# Altium schematic sheet [08] - MMC SLOT.SchDoc: IMXBB
size A3; DocumentNumber: 8; Revision: 2.0; SheetNumber: 8; SheetTotal: 13
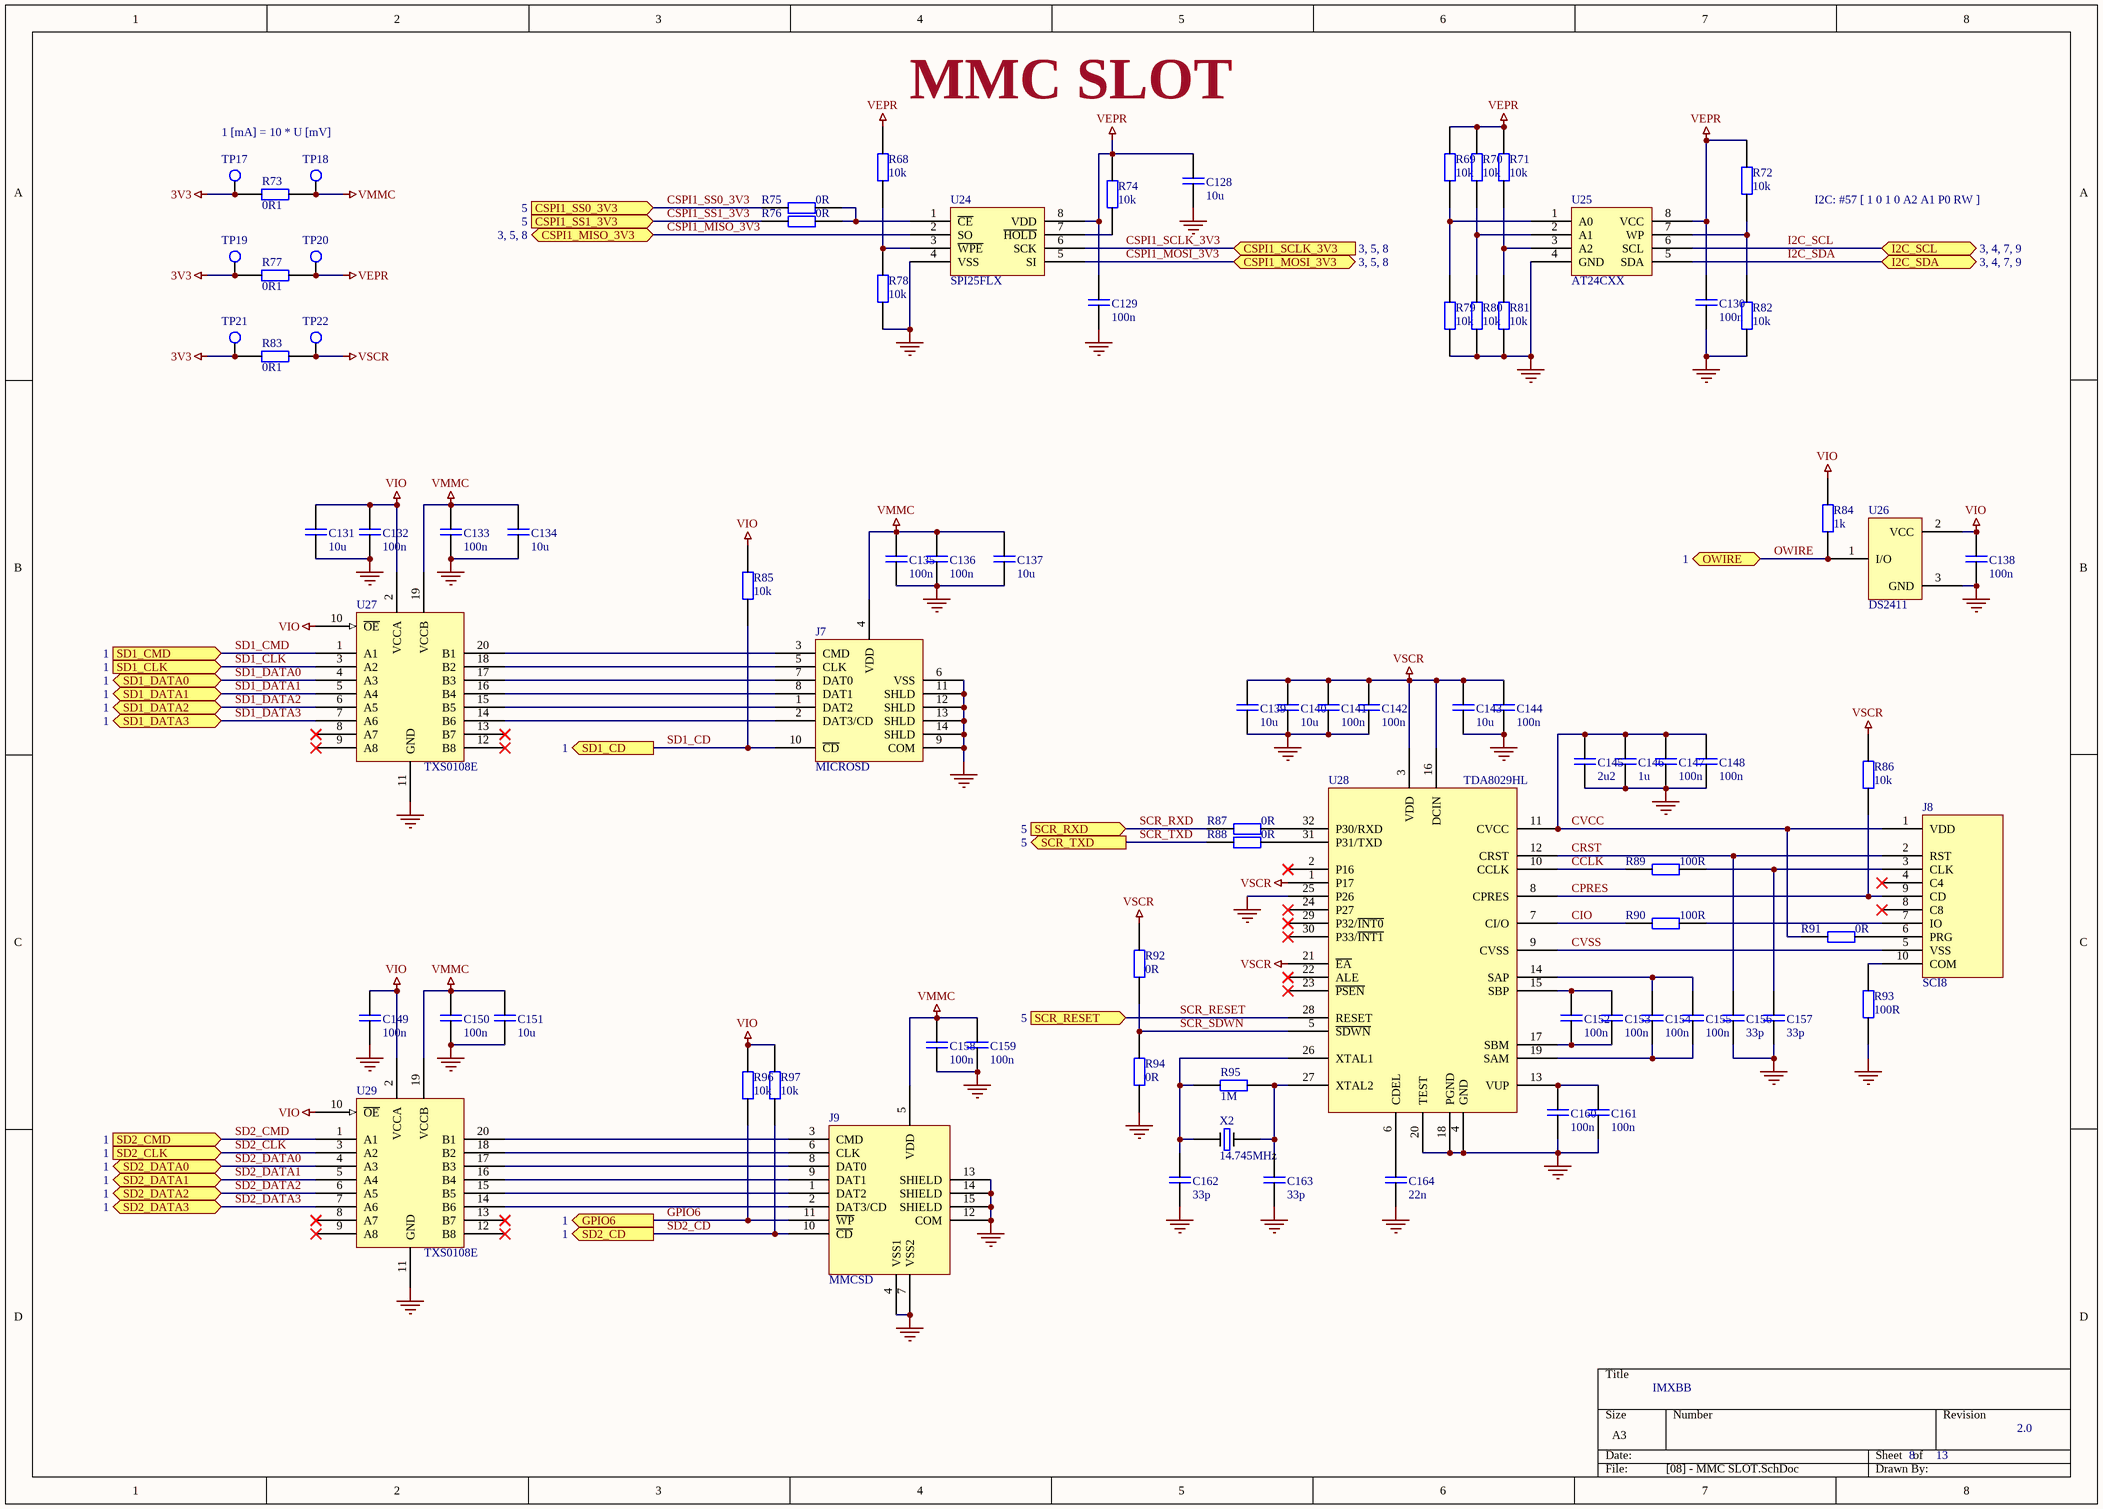
[diagram p0: [08] - MMC SLOT.SchDoc]

## Parts
C128  10u  [0805]
C129  100n  [0603]
C130  100n  [0603]
C131  10u  [0805]
C132  100n  [0603]
C133  100n  [0603]
C134  10u  [0805]
C135  100n  [0603]
C136  100n  [0603]
C137  10u  [0805]
C138  100n  [0603]
C139  10u  [0805]
C140  10u  [0805]
C141  100n  [0603]
C142  100n  [0603]
C143  10u  [0805]
C144  100n  [0603]
C145  2u2  [0603]
C146  1u  [0603]
C147  100n  [0603]
C148  100n  [0603]
C149  100n  [0603]
C150  100n  [0603]
C151  10u  [0805]
C152  100n  [0603]
C153  100n  [0603]
C154  100n  [0603]
C155  100n  [0603]
C156  33p  [0603]
C157  33p  [0603]
C158  100n  [0603]
C159  100n  [0603]
C160  100n  [0603]
C161  100n  [0603]
C162  33p  [0603]
C163  33p  [0603]
C164  22n  [0603]
J7  MICROSD  [uSD10]
J8  SCI8  [SCI8F]
J9  MMCSD  [SDCMF-109]
R68  10k  [0603]
R69  10k  [0603]
R70  10k  [0603]
R71  10k  [0603]
R72  10k  [0603]
R73  0R1  [0603]
R74  10k  [0603]
R75  0R  [0603]
R76  0R  [0603]
R77  0R1  [0603]
R78  10k  [0603]
R79  10k  [0603]
R80  10k  [0603]
R81  10k  [0603]
R82  10k  [0603]
R83  0R1  [0603]
R84  1k  [0603]
R85  10k  [0603]
R86  10k  [0603]
R87  0R  [0603]
R88  0R  [0603]
R89  100R  [0603]
R90  100R  [0603]
R91  0R  [0603]
R92  0R  [0603]
R93  100R  [0603]
R94  0R  [0603]
R95  1M  [0603]
R96  10k  [0603]
R97  10k  [0603]
TP17  TESTPOINT  [TESTPOINT_2mm]  (value not drawn)
TP18  TESTPOINT  [TESTPOINT_2mm]  (value not drawn)
TP19  TESTPOINT  [TESTPOINT_2mm]  (value not drawn)
TP20  TESTPOINT  [TESTPOINT_2mm]  (value not drawn)
TP21  TESTPOINT  [TESTPOINT_2mm]  (value not drawn)
TP22  TESTPOINT  [TESTPOINT_2mm]  (value not drawn)
U24  SPI25FLX  [SOIC8]
U25  AT24CXX  [SOIC8]
U26  DS2411  [SOT23]
U27  TXS0108E  [TSSOP20]
U28  TDA8029HL  [LQFP32]
U29  TXS0108E  [TSSOP20]
X2  14.745MHz  [HC494H]

## Ports
CSPI1_MISO_3V3 (bidir, see 3, 5, 8), CSPI1_MOSI_3V3 (bidir, see 3, 5, 8), CSPI1_SCLK_3V3 (in, see 3, 5, 8), CSPI1_SS0_3V3 (in, see 5), CSPI1_SS1_3V3 (in, see 5), GPIO6 (out, see 1), I2C_SCL (bidir, see 3, 4, 7, 9), I2C_SDA (bidir, see 3, 4, 7, 9), OWIRE (bidir, see 1), SCR_RESET (in, see 5), SCR_RXD (in, see 5), SCR_TXD (out, see 5), SD1_CD (out, see 1), SD1_CLK (in, see 1), SD1_CMD (in, see 1), SD1_DATA0 (bidir, see 1), SD1_DATA1 (bidir, see 1), SD1_DATA2 (bidir, see 1), SD1_DATA3 (bidir, see 1), SD2_CD (out, see 1), SD2_CLK (in, see 1), SD2_CMD (in, see 1), SD2_DATA0 (bidir, see 1), SD2_DATA1 (bidir, see 1), SD2_DATA2 (bidir, see 1), SD2_DATA3 (bidir, see 1)

## Nets
3V3: R73.1 R77.1 R83.1 TP17.1 TP19.1 TP21.1
GND: C128.1 C129.1 C130.1 C131.1 C132.1 C133.1 C134.1 C135.1 C136.1 C137.1 C138.1 C139.1 C140.1 C141.1 C142.1 C143.1 C144.1 C145.1 C146.1 C147.1 C148.1 C149.1 C150.1 C151.1 C156.1 C157.1 C158.1 C159.1 C160.1 C161.1 C162.1 C163.1 C164.1 J7.6(VSS) J7.9(COM) J7.11(SHLD) J7.12(SHLD) J7.13(SHLD) J7.14(SHLD) J9.4(VSS1) J9.7(VSS2) J9.12(COM) J9.13(SHIELD) J9.14(SHIELD) J9.15(SHIELD) R78.2 R79.2 R80.2 R81.2 R82.2 R93.1 R94.1 U24.4(VSS) U25.4(GND) U26.3(GND) U27.11(GND) U28.4(GND) U28.18(PGND) U28.20(TEST) U28.25(P26) U29.11(GND)
VEPR: C128.2 C129.2 C130.2 R68.1 R69.1 R70.1 R71.1 R72.1 R74.1 R77.2 TP20.1 U24.8(VDD) U25.8(VCC)
VIO: C131.2 C132.2 C138.2 C149.2 R84.1 R85.1 R96.1 R97.1 U26.2(VCC) U27.2(VCCA) U27.10(~{OE}) U29.2(VCCA) U29.10(~{OE})
VMMC: C133.2 C134.2 C135.2 C136.2 C137.2 C150.2 C151.2 C158.2 C159.2 J7.4(VDD) J9.5(VDD) R73.2 TP18.1 U27.19(VCCB) U29.19(VCCB)
VSCR: C139.2 C140.2 C141.2 C142.2 C143.2 C144.2 R83.2 R86.2 R92.2 TP22.1 U28.1(P17) U28.3(VDD) U28.16(DCIN) U28.21(~{EA})
CCLK: R89.1 U28.10(CCLK)
CIO: R90.1 U28.7(CI/O)
CPRES: J8.9(CD) R86.1 U28.8(CPRES)
CRST: C156.2 J8.2(RST) U28.12(CRST)
CSPI1_MISO_3V3: U24.2(SO) ; port CSPI1_MISO_3V3
CSPI1_MOSI_3V3: U24.5(SI) ; port CSPI1_MOSI_3V3
CSPI1_SCLK_3V3: U24.6(SCK) ; port CSPI1_SCLK_3V3
CSPI1_SS0_3V3: R75.1 ; port CSPI1_SS0_3V3
CSPI1_SS1_3V3: R76.1 ; port CSPI1_SS1_3V3
CVCC: C145.2 C146.2 C147.2 C148.2 J8.1(VDD) R91.1 U28.11(CVCC)
CVSS: J8.5(VSS) U28.9(CVSS)
GPIO6: J9.11(~{WP}) R96.2 ; port GPIO6
I2C_SCL: U25.6(SCL) ; port I2C_SCL
I2C_SDA: U25.5(SDA) ; port I2C_SDA
OWIRE: R84.2 U26.1(I/O) ; port OWIRE
SCR_RESET: U28.28(RESET) ; port SCR_RESET
SCR_RXD: R87.1 ; port SCR_RXD
SCR_SDWN: R92.1 R94.2 U28.5(~{SDWN})
SCR_TXD: R88.1 ; port SCR_TXD
SD1_CD: J7.10(~{CD}) R85.2 ; port SD1_CD
SD1_CLK: U27.3(A2) ; port SD1_CLK
SD1_CMD: U27.1(A1) ; port SD1_CMD
SD1_DATA0: U27.4(A3) ; port SD1_DATA0
SD1_DATA1: U27.5(A4) ; port SD1_DATA1
SD1_DATA2: U27.6(A5) ; port SD1_DATA2
SD1_DATA3: U27.7(A6) ; port SD1_DATA3
SD2_CD: J9.10(~{CD}) R97.2 ; port SD2_CD
SD2_CLK: U29.3(A2) ; port SD2_CLK
SD2_CMD: U29.1(A1) ; port SD2_CMD
SD2_DATA0: U29.4(A3) ; port SD2_DATA0
SD2_DATA1: U29.5(A4) ; port SD2_DATA1
SD2_DATA2: U29.6(A5) ; port SD2_DATA2
SD2_DATA3: U29.7(A6) ; port SD2_DATA3
NetC152_1: C152.1 C153.1 U28.17(SBM)
NetC152_2: C152.2 C153.2 U28.15(SBP)
NetC154_1: C154.1 C155.1 U28.19(SAM)
NetC154_2: C154.2 C155.2 U28.14(SAP)
NetC157_2: C157.2 J8.3(CLK) R89.2
NetC160_2: C160.2 C161.2 U28.13(VUP)
NetC162_2: C162.2 R95.2 U28.26(XTAL1) X2.1
NetC163_2: C163.2 R95.1 U28.27(XTAL2) X2.2
NetC164_2: C164.2 U28.6(CDEL)
NetJ7_1: J7.1(DAT2) U27.15(B5)
NetJ7_2: J7.2(DAT3/CD) U27.14(B6)
NetJ7_3: J7.3(CMD) U27.20(B1)
NetJ7_5: J7.5(CLK) U27.18(B2)
NetJ7_7: J7.7(DAT0) U27.17(B3)
NetJ7_8: J7.8(DAT1) U27.16(B4)
NetJ8_6: J8.6(PRG) R91.2
NetJ8_7: J8.7(IO) R90.2
NetJ8_10: J8.10(COM) R93.2
NetJ9_1: J9.1(DAT2) U29.15(B5)
NetJ9_2: J9.2(DAT3/CD) U29.14(B6)
NetJ9_3: J9.3(CMD) U29.20(B1)
NetJ9_6: J9.6(CLK) U29.18(B2)
NetJ9_8: J9.8(DAT0) U29.17(B3)
NetJ9_9: J9.9(DAT1) U29.16(B4)
NetR68_2: R68.2 R78.1 U24.3(~{WPE})
NetR69_2: R69.2 R79.1 U25.1(A0)
NetR70_2: R70.2 R80.1 U25.2(A1)
NetR71_2: R71.2 R81.1 U25.3(A2)
NetR72_2: R72.2 R82.1 U25.7(WP)
NetR74_2: R74.2 U24.7(~{HOLD})
NetR75_2: R75.2 R76.2 U24.1(~{CE})
NetR87_2: R87.2 U28.32(P30/RXD)
NetR88_2: R88.2 U28.31(P31/TXD)

Not connected (* = marked no-connect by the designer): J8 4(C4)* 8(C8)*; U27 8(A7)* 9(A8)* 12(B8)* 13(B7)*; U28 2(P16)* 22(ALE)* 23(~{PSEN})* 24(P27)* 29(P32/~{INT0})* 30(P33/~{INT1})*; U29 8(A7)* 9(A8)* 12(B8)* 13(B7)*

## Notes on the sheet
- MMC SLOT
- 1 [mA] = 10 * U [mV]
- I2C: #57 [ 1 0 1 0 A2 A1 P0 RW ]

## Library data of the parts
C128-C164 = C
R68-R97 = R
TP17-TP22 = TESTPOINT: Testpoint pad; Order number: no component; Component class: TP; Producer: n/a; Assembly type: no component
X2 = XTAL